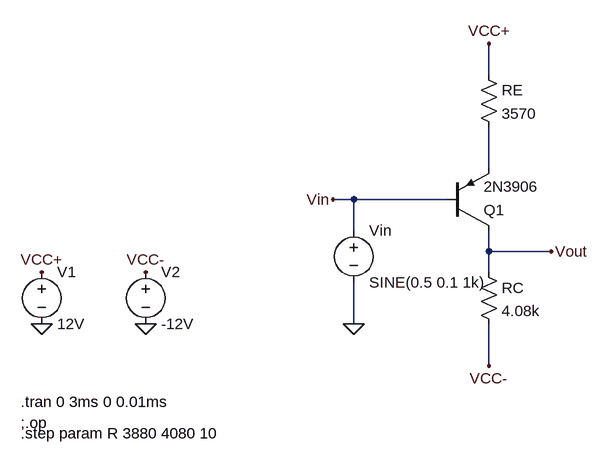
[diagram p0: schematic PNP DC Offset.asc]
PNP DC Offset.asc, the LTspice schematic file:
Version 4
SHEET 1 1016 680
WIRE 848 -176 848 -224
WIRE 848 -32 848 -96
WIRE 640 16 608 16
WIRE 784 16 640 16
WIRE 640 64 640 16
WIRE 848 96 848 64
WIRE 944 96 848 96
WIRE 848 128 848 96
WIRE 640 208 640 144
WIRE 848 272 848 208
FLAG 640 208 0
FLAG 320 208 0
FLAG 160 208 0
FLAG 160 128 VCC+
FLAG 320 128 VCC-
FLAG 848 272 VCC-
FLAG 848 -224 VCC+
FLAG 944 96 Vout
FLAG 608 16 Vin
SYMBOL voltage 160 112 R0
WINDOW 123 0 0 Left 0
WINDOW 39 0 0 Left 0
SYMATTR InstName V1
SYMATTR Value 12V
SYMBOL voltage 320 112 R0
WINDOW 123 0 0 Left 0
WINDOW 39 0 0 Left 0
SYMATTR InstName V2
SYMATTR Value -12V
SYMBOL voltage 640 48 R0
WINDOW 123 0 0 Left 0
WINDOW 39 0 0 Left 0
SYMATTR InstName Vin
SYMATTR Value SINE(0.5 0.1 1k)
SYMBOL pnp 784 64 M180
SYMATTR InstName Q1
SYMATTR Value 2N3906
SYMBOL res 832 112 R0
SYMATTR InstName RC
SYMATTR Value 4.08k
SYMBOL res 832 -192 R0
SYMATTR InstName RE
SYMATTR Value 3570
TEXT 128 328 Left 2 !.tran 0 3ms 0 0.01ms
TEXT 128 360 Left 2 !;.op
TEXT 128 376 Left 2 !.step param R 3880 4080 10

The netlist it stands for:
* PNP DC Offset.asc
V1 VCC+ 0 12V
V2 VCC- 0 -12V
Vin Vin 0 SINE(0.5 0.1 1k)
Q1 Vout Vin N001 0 2N3906
RC Vout VCC- 4.08k
RE VCC+ N001 3570
.model NPN NPN
.model PNP PNP
.lib standard.bjt
.tran 0 3ms 0 0.01ms
;.op
.step param R 3880 4080 10
.backanno
.end